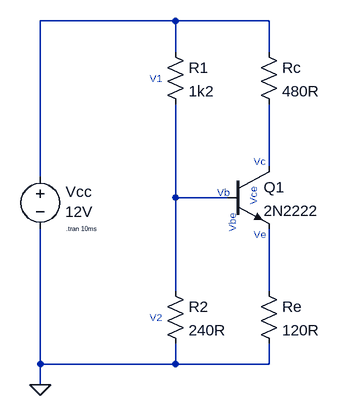
[diagram p0: schematic pdt-projeto-com-transistores.asc]
pdt-projeto-com-transistores.asc, the LTspice schematic file:
Version 4
SHEET 1 880 680
WIRE 160 -112 -48 -112
WIRE 304 -112 160 -112
WIRE 160 -64 160 -112
WIRE 304 -64 304 -112
WIRE 304 112 304 16
WIRE -48 128 -48 -112
WIRE 160 160 160 16
WIRE 240 160 160 160
WIRE 160 304 160 160
WIRE 304 304 304 208
WIRE -48 416 -48 208
WIRE 160 416 160 384
WIRE 160 416 -48 416
WIRE 304 416 304 384
WIRE 304 416 160 416
WIRE -48 448 -48 416
FLAG -48 448 0
SYMBOL voltage -48 112 R0
WINDOW 0 39 39 Left 2
WINDOW 3 38 70 Left 2
WINDOW 123 0 0 Left 0
WINDOW 39 0 0 Left 0
SYMATTR InstName Vcc
SYMATTR Value 12V
SYMBOL npn 240 112 R0
SYMATTR InstName Q1
SYMATTR Value 2N2222
SYMBOL res 288 -80 R0
SYMATTR InstName Rc
SYMATTR Value 480R
SYMBOL res 288 288 R0
SYMATTR InstName Re
SYMATTR Value 120R
SYMBOL res 144 -80 R0
SYMATTR InstName R1
SYMATTR Value 1k2
SYMBOL res 144 288 R0
SYMATTR InstName R2
SYMATTR Value 240R
TEXT -8 208 Left 0 !.tran 10ms
TEXT 280 104 Left 1 ;Vc
TEXT 224 152 Left 1 ;Vb
TEXT 280 216 Left 1 ;Ve
TEXT 280 144 VRight 1 ;Vce
TEXT 248 184 VRight 1 ;Vbe
TEXT 120 -24 Left 1 ;V1
TEXT 120 344 Left 1 ;V2

The netlist it stands for:
* pdt-projeto-com-transistores.asc
Vcc N001 0 12V
Q1 N002 N003 N004 0 2N2222
Rc N001 N002 480R
Re N004 0 120R
R1 N001 N003 1k2
R2 N003 0 240R
.model NPN NPN
.model PNP PNP
.lib standard.bjt
.tran 10ms
* Vc
* Vb
* Ve
* Vce
* Vbe
* V1
* V2
.backanno
.end